# EasyEDA schematic SCH_reaction_2026-08-12.json
TITLE: Sheet_1; REV: 1.0; Date: 2026-08-12; Sheet: 1/1; Drawn By: desmondgcannon; Company: Your Company
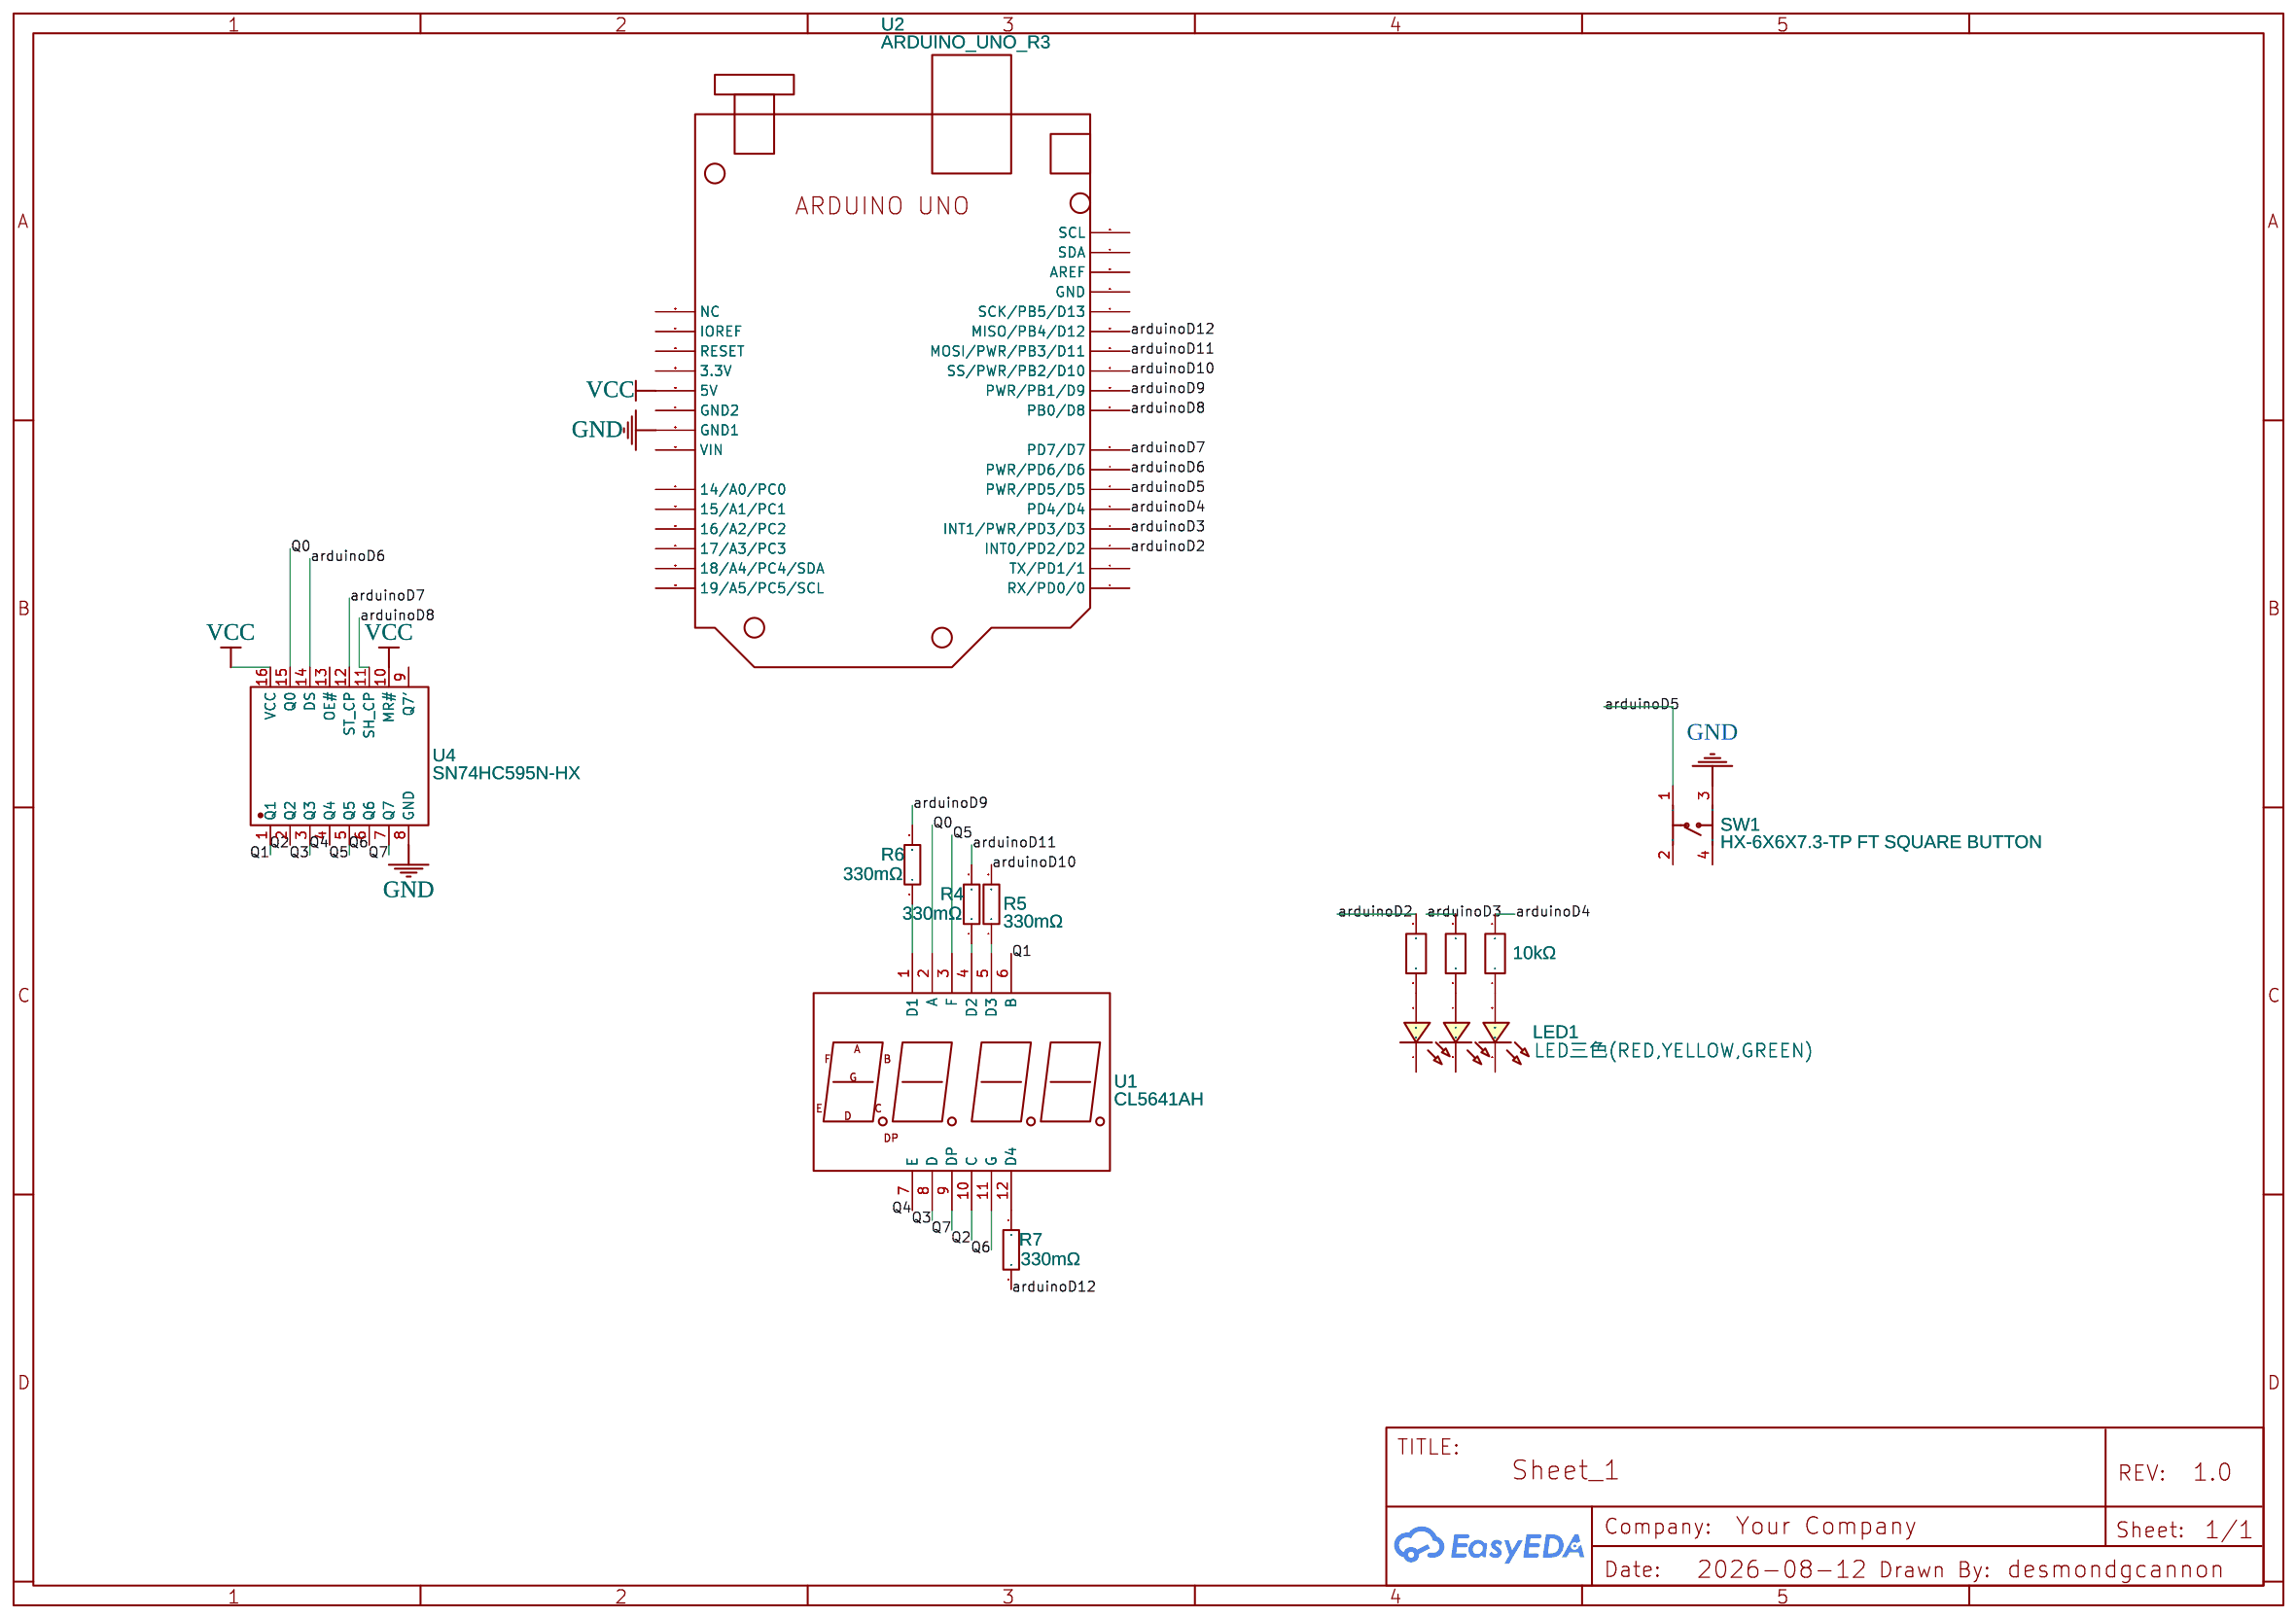
[diagram p0: schematic sheet]

## Parts
LED1  LED三色(RED,YELLOW,GREEN)  [LED-TH_6P_LED4GREEN]
R1  10kΩ  [R0805]
R2  10kΩ  [R0805]
R3  10kΩ  [R0805]
R4  330mΩ  [R0805]
R5  330mΩ  [R0805]
R6  330mΩ  [R0805]
R7  330mΩ  [R0805]
SW1  HX-6X6X7.3-TP FT SQUARE BUTTON  [SW-SMD_4P-L6.0-W6.0-P4.50-LS9.0-H7.3]
U1  CL5641AH  [LED-SEG-CL5641AH]
U2  ARDUINO_UNO_R3  [UNO_R3_TOTO]
U4  SN74HC595N-HX  [PDIP-16_L19.1-W6.4-P2.54-LS7.62-BL]

## Library data of the parts
LED1 = LED三色(RED,YELLOW,GREEN): Contributor: lcsc; Supplier: LCSC; Supplier Part: C9900027004; Manufacturer: null; Manufacturer Part: LED三色(Red,Yellow,Green)
R1-R3 = FRC0805J103TS: Contributor: lcsc; Supplier: LCSC; Supplier Part: C2930231; Manufacturer: FOJAN(富捷); JLCPCB Part Class: Extended Part
R4-R7 = SR732ATTDR330F: Contributor: LCSC; Supplier: LCSC; Supplier Part: C186585; Manufacturer: KOA; JLCPCB Part Class: Extended Part
SW1 = HX-6X6X7.3-TP FT SQUARE BUTTON: Supplier: LCSC; Supplier Part: C49234152; Manufacturer: hanxia(韩下); Manufacturer Part: HX-6x6x7.3-TP FT square button; JLCPCB Part Class: Extended Part; Contributor: lcsc
U1 = CL5641AH: Manufacturer: uxcell; Supplier: Amazon; Supplier Part: B07GTNR8JX; link: https://www.amazon.com/gp/product/B07GTNR8JX; Contributor: nathmon565
U2 = ARDUINO_UNO_R3: Contributor: ShameerMasroor; sourceId: frlCUcuMG; Manufacturer: Arduino CC
U4 = SN74HC595N-HX: Supplier: LCSC; Supplier Part: C54529383; Manufacturer: ZHHXDZ(海芯电子); Contributor: lcsc; JLCPCB Part Class: Extended Part

## Nets
GND: SW1.3(C) U2.26(GND1) U4.8(GND)
VCC: U2.28(5V) U4.10(MR#) U4.16(VCC)
arduinoD2: R1.2 U2.3(INT0/PD2/D2)
arduinoD3: R2.2 U2.4(INT1/PWR/PD3/D3)
arduinoD4: R3.2 U2.5(PD4/D4)
arduinoD5: SW1.1(A) U2.6(PWR/PD5/D5)
arduinoD6: U2.7(PWR/PD6/D6) U4.14(DS)
arduinoD7: U2.8(PD7/D7) U4.12(ST_CP)
arduinoD8: U2.9(PB0/D8) U4.11(SH_CP)
arduinoD9: R6.2 U2.10(PWR/PB1/D9)
arduinoD10: R5.2 U2.11(SS/PWR/PB2/D10)
arduinoD11: R4.2 U2.12(MOSI/PWR/PB3/D11)
arduinoD12: R7.2 U2.13(MISO/PB4/D12)
Q0: U1.2(A) U4.15(Q0)
Q1: U1.6(B) U4.1(Q1)
Q2: U1.10(C) U4.2(Q2)
Q3: U1.8(D) U4.3(Q3)
Q4: U1.7(E) U4.4(Q4)
Q5: U1.3(F) U4.5(Q5)
Q6: U1.11(G) U4.6(Q6)
Q7: U1.9(DP) U4.7(Q7)
Net-(LED1-2): LED1.2 R1.1
Net-(LED1-4): LED1.4 R2.1
Net-(LED1-6): LED1.6 R3.1
Net-(R4-1): R4.1 U1.4(D2)
Net-(R5-1): R5.1 U1.5(D3)
Net-(R6-1): R6.1 U1.1(D1)
Net-(R7-1): R7.1 U1.12(D4)

Not connected (* = marked no-connect by the designer): LED1 1 3 5; SW1 2(B) 4(D); U2 1(RX/PD0/0) 2(TX/PD1/1) 14(SCK/PB5/D13) 15(GND) 16(AREF) 17(SDA) 18(SCL) 19(19/A5/PC5/SCL) 20(18/A4/PC4/SDA) 21(17/A3/PC3) 22(16/A2/PC2) 23(15/A1/PC1) 24(14/A0/PC0) 25(VIN) 27(GND2) 29(3.3V) 30(RESET) 31(IOREF) 32(NC); U4 9(Q7′) 13(OE#)
